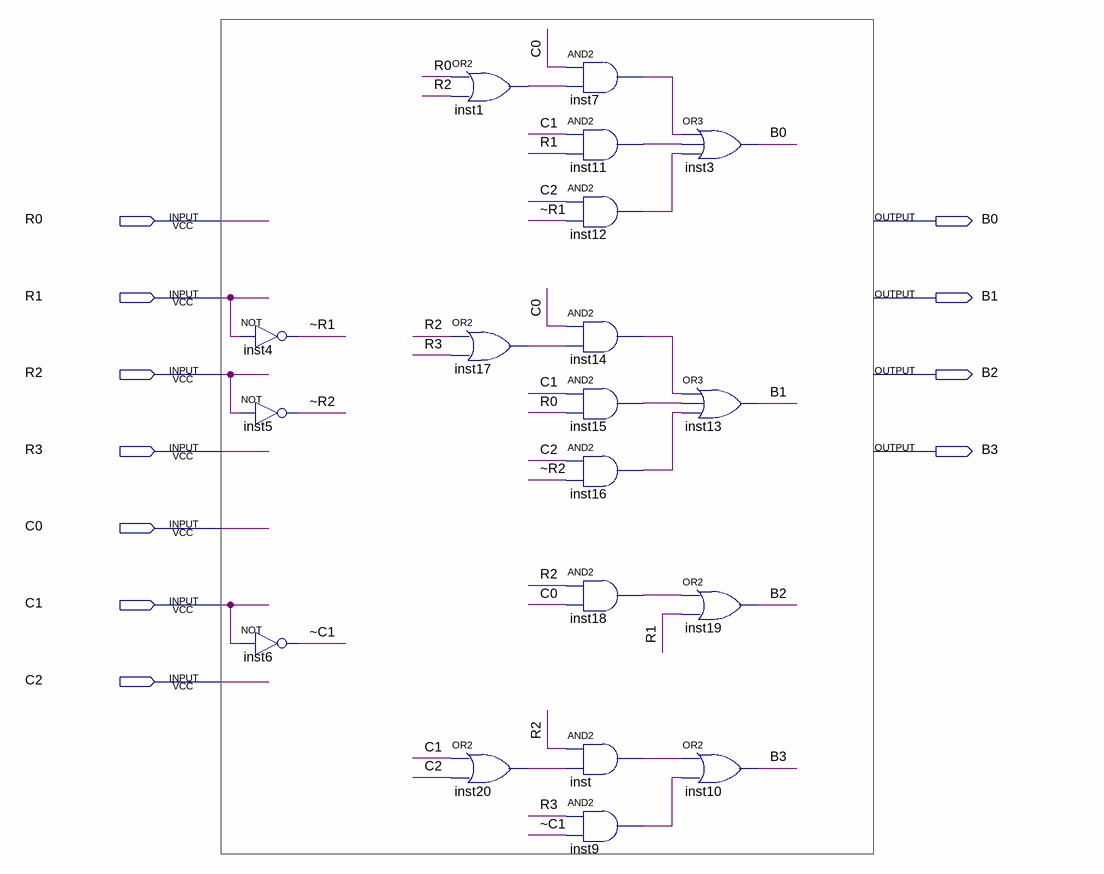
[diagram p0: schematic sheet]
// Quartus schematic keypad.bdf as structural Verilog: 19 symbols, 11 pins
module keypad (
  input  R0,
  input  R1,
  input  R2,
  input  R3,
  input  C0,
  input  C1,
  input  C2,
  output B0,
  output B1,
  output B2,
  output B3
);

  wire inst1_out, inst7_out, inst9_out, inst11_out, inst12_out, inst14_out, inst15_out, inst16_out,
       inst17_out, inst18_out, inst20_out, inst_out, \~C1 , \~R1 , \~R2 ;

  not inst4 (\~R1 , R1);
  not inst5 (\~R2 , R2);
  not inst6 (\~C1 , C1);
  or inst1 (inst1_out, R0, R2);
  or inst17 (inst17_out, R2, R3);
  or inst20 (inst20_out, C1, C2);
  and inst7 (inst7_out, C0, inst1_out);
  and inst11 (inst11_out, C1, R1);
  and inst12 (inst12_out, C2, \~R1 );
  and inst14 (inst14_out, C0, inst17_out);
  and inst15 (inst15_out, C1, R0);
  and inst16 (inst16_out, C2, \~R2 );
  and inst18 (inst18_out, R2, C0);
  and inst (inst_out, R2, inst20_out);
  and inst9 (inst9_out, R3, \~C1 );
  or inst3 (B0, inst7_out, inst11_out, inst12_out);
  or inst13 (B1, inst14_out, inst15_out, inst16_out);
  or inst19 (B2, inst18_out, R1);
  or inst10 (B3, inst_out, inst9_out);
endmodule
